# Altium schematic sheet NNP-DWG-125-001-000 PG4 Schematic Drawing Pg8.SchDoc
size B; Organization: Synapse Biomedical Inc.; Address1: 300 Artino St.; Address2: Oberlin, OH 44074; DocumentNumber: 51-2002-01; Revision: 04; SheetNumber: 8; SheetTotal: 8; PageSetup: Record=PageOptions|CenterHorizontal=True|CenterVertical=True|PrintScale=1.09|XCorrection=1.00|YCorrection=1.00|PrintKind=0|BorderSize=5000000|LeftOffset=0|BottomOffset=0|Orientation=2|PaperLength=4318|PaperWidth=2794|Scale=100|PaperSource=7|PrintQuality=-3|MediaType=1|DitherType=10|PrintScaleMode=1|PaperKind=11" x 17"|PaperIndex=17
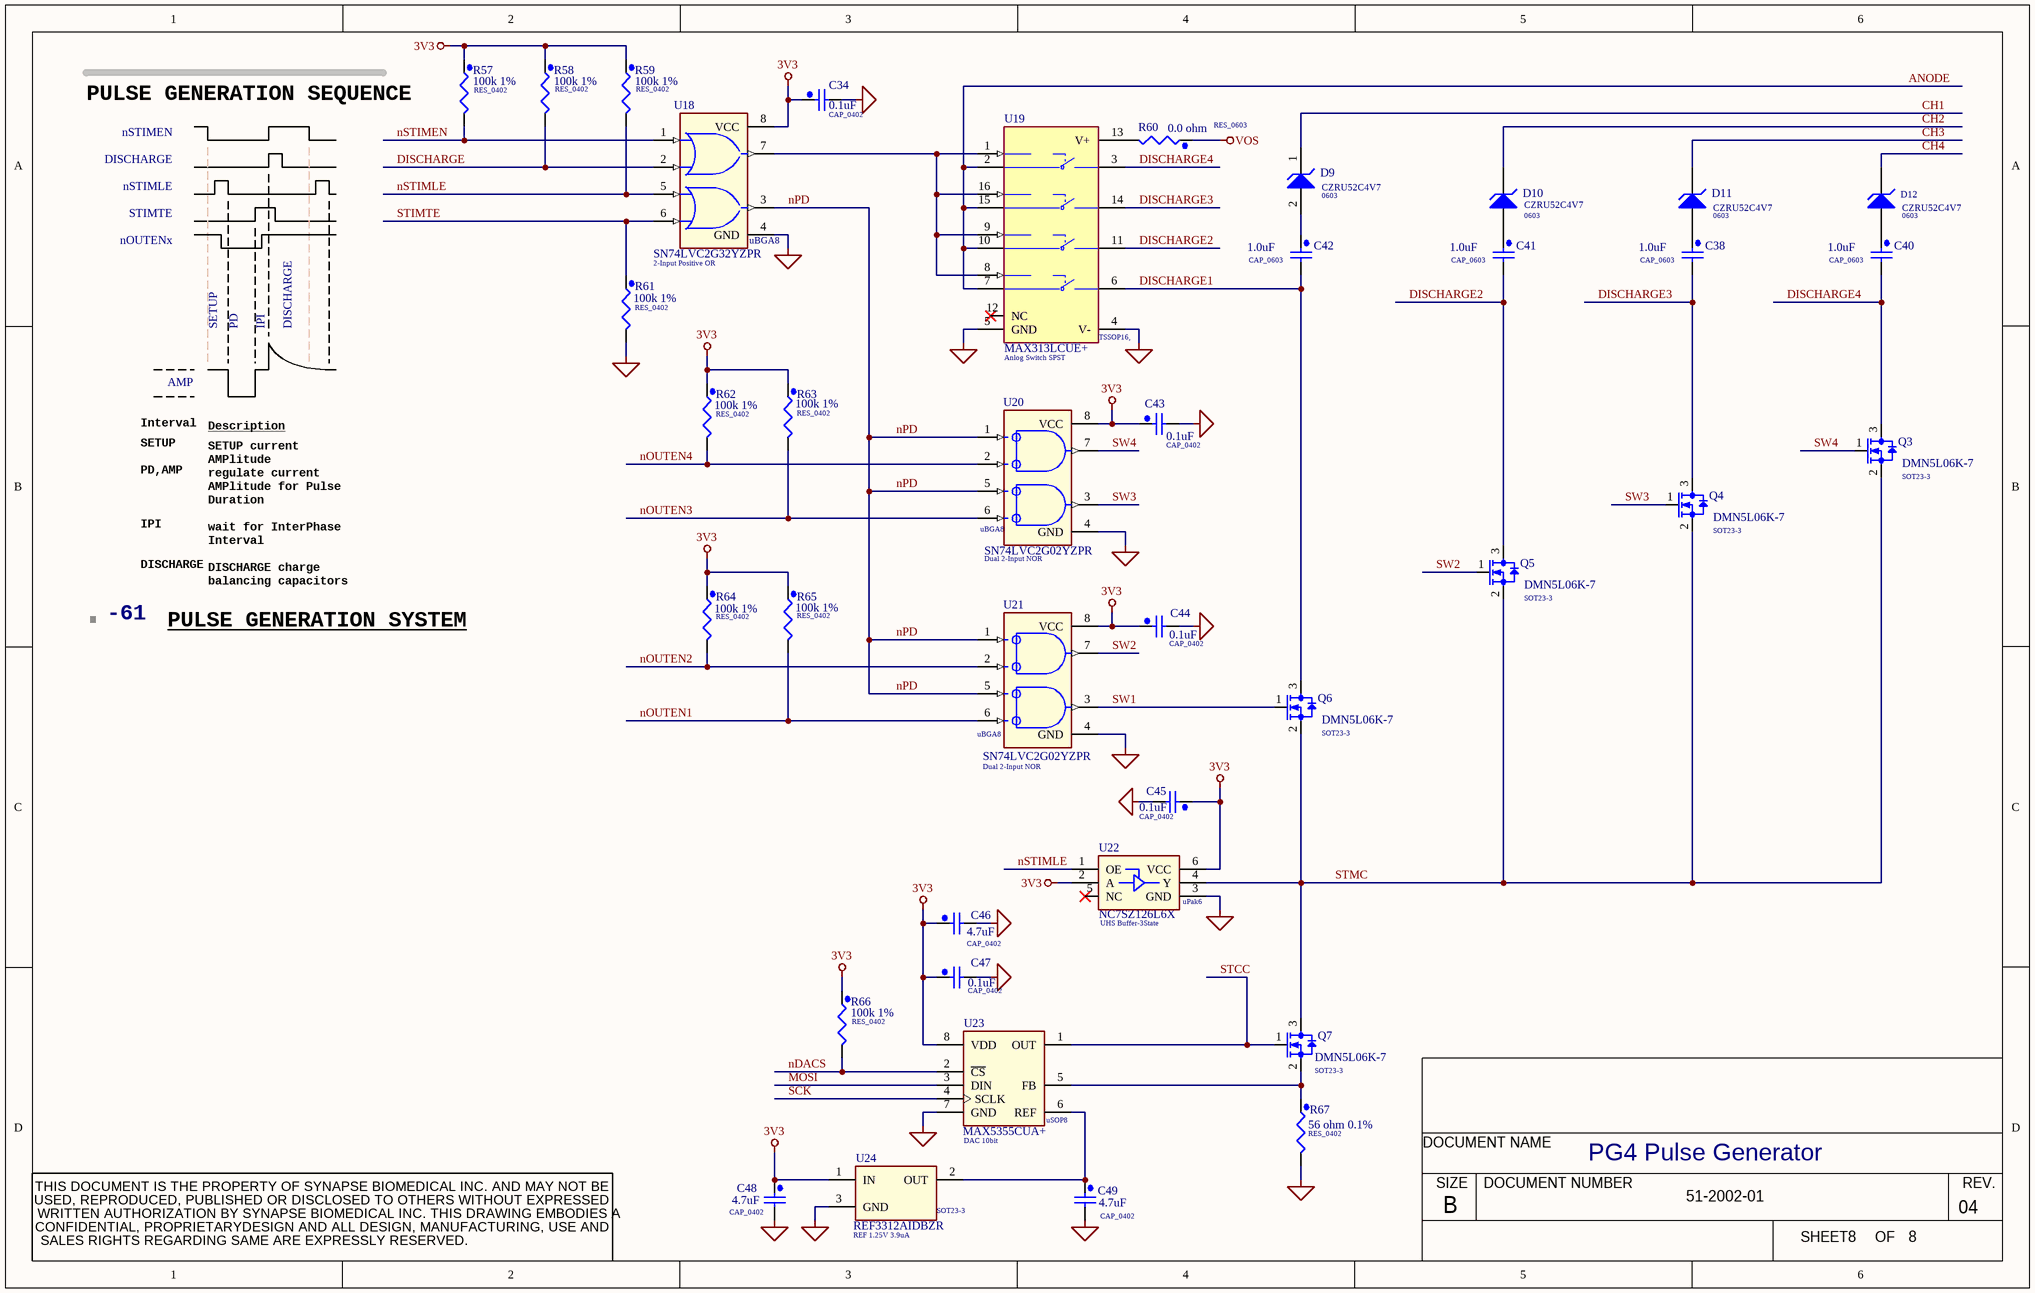
[diagram p0: NNP-DWG-125-001-000 PG4 Schematic Drawing Pg8.SchDoc]

## Parts
-61  XDESCRIPTION: PULSE GENERATION SYSTEM  (hidden comment: BOM_S1)  (no BOM)
C34  value 0.1uF  [CAP_0402]  (hidden comment: C_100n_X7R_16_0402_10%)
C38  value 1.0uF  [CAP_0603]  (hidden comment: C_1u_X5R_50_0603_10%)
C40  value 1.0uF  [CAP_0603]  (hidden comment: C_1u_X5R_50_0603_10%)
C41  value 1.0uF  [CAP_0603]  (hidden comment: C_1u_X5R_50_0603_10%)
C42  value 1.0uF  [CAP_0603]  (hidden comment: C_1u_X5R_50_0603_10%)
C43  value 0.1uF  [CAP_0402]  (hidden comment: C_100n_X7R_16_0402_10%)
C44  value 0.1uF  [CAP_0402]  (hidden comment: C_100n_X7R_16_0402_10%)
C45  value 0.1uF  [CAP_0402]  (hidden comment: C_100n_X7R_16_0402_10%)
C46  value 4.7uF  [CAP_0402]  (hidden comment: C_4u7_X5R_6V3_0402_20%)
C47  value 0.1uF  [CAP_0402]  (hidden comment: C_100n_X7R_16_0402_10%)
C48  value 4.7uF  [CAP_0402]  (hidden comment: C_4u7_X5R_6V3_0402_20%)
C49  value 4.7uF  [CAP_0402]  (hidden comment: C_4u7_X5R_6V3_0402_20%)
D9  PackageDescription: 0603  MPN: CZRU52C4V7  [DIODES_SOD-523FL]  (hidden comment: Zener Diode, 15V, 150mW, 0603, RoHS)
D10  PackageDescription: 0603  MPN: CZRU52C4V7  [DIODES_SOD-523FL]  (hidden comment: Zener Diode, 15V, 150mW, 0603, RoHS)
D11  PackageDescription: 0603  MPN: CZRU52C4V7  [DIODES_SOD-523FL]  (hidden comment: Zener Diode, 15V, 150mW, 0603, RoHS)
D12  PackageDescription: 0603  MPN: CZRU52C4V7  [DIODES_SOD-523FL]  (hidden comment: Zener Diode, 15V, 150mW, 0603, RoHS)
Q3  value DMN5L06K-7  [SOT23-3]  (hidden comment: M_50_300m_SOT23)
Q4  value DMN5L06K-7  [SOT23-3]  (hidden comment: M_50_300m_SOT23)
Q5  value DMN5L06K-7  [SOT23-3]  (hidden comment: M_50_300m_SOT23)
Q6  value DMN5L06K-7  [SOT23-3]  (hidden comment: M_50_300m_SOT23)
Q7  value DMN5L06K-7  [SOT23-3]  (hidden comment: M_50_300m_SOT23)
R57  value 100k 1%  [RES_0402]  (hidden comment: R_100k_0402)
R58  value 100k 1%  [RES_0402]  (hidden comment: R_100k_0402)
R59  value 100k 1%  [RES_0402]  (hidden comment: R_100k_0402)
R60  value 0.0 ohm  [RES_0603]  (hidden comment: R_0_0603)
R61  value 100k 1%  [RES_0402]  (hidden comment: R_100k_0402)
R62  value 100k 1%  [RES_0402]  (hidden comment: R_100k_0402)
R63  value 100k 1%  [RES_0402]  (hidden comment: R_100k_0402)
R64  value 100k 1%  [RES_0402]  (hidden comment: R_100k_0402)
R65  value 100k 1%  [RES_0402]  (hidden comment: R_100k_0402)
R66  value 100k 1%  [RES_0402]  (hidden comment: R_100k_0402)
R67  value 56 ohm 0.1%  [RES_0402]  (hidden comment: R_56_0402_0%1)
U18  2-Input Positive OR  PackageDescription: uBGA8  MPN: SN74LVC2G32YZPR  [DSBGA-8-YZP]
U19  Anlog Switch SPST  PackageDescription: TSSOP16,  MPN: MAX313LCUE+  [TSSOP16]
U20  Dual 2-Input NOR  PackageDescription: uBGA8  MPN: SN74LVC2G02YZPR  [DSBGA-8-YZP]
U21  Dual 2-Input NOR  PackageDescription: uBGA8  MPN: SN74LVC2G02YZPR  [DSBGA-8-YZP]
U22  UHS Buffer-3State  [uPak6]
U23  DAC 10bit  PackageDescription: uSOP8  [uSOP-8L]
U24  REF 1.25V 3.9uA  MPN: REF3312AIDBZR  [SOT23-3]

## Nets
3V3: C34.1 C43.1 C44.1 C45.1 C46.1 C47.1 C48.1 R57.1 R58.1 R59.1 R62.1 R63.1 R64.1 R65.1 R66.1 U18.8(VCC) U20.8(VCC) U21.8(VCC) U22.2(A) U22.6(VCC) U23.8(VDD) U24.1(IN)
GND: C34.2 C43.2 C44.2 C45.2 C46.2 C47.2 C48.2 C49.2 R61.2 R67.2 U18.4(GND) U19.4(V-) U19.5(GND) U20.4(GND) U21.4(GND) U22.3(GND) U23.7(GND) U24.3(GND)
VOS: R60.1
ANODE: U19.2(COM1) U19.7(COM4) U19.10(COM3) U19.15(COM2)
CH1: D9.1
CH2: D10.1(C)
CH3: D11.1(C)
CH4: D12.1(C)
DISCHARGE: R58.2 U18.2(1B)
DISCHARGE1: C42.2 Q6.3(D) U19.6(NO4)
DISCHARGE2: C41.2 Q5.3(D) U19.11(NO3)
DISCHARGE3: C38.2 Q4.3(D) U19.14(NO2)
DISCHARGE4: C40.2 Q3.3(D) U19.3(NO1)
MOSI: U23.3(DIN)
nDACS: R66.2 U23.2(~{CS})
nOUTEN1: R65.2 U21.6(2B)
nOUTEN2: R64.2 U21.2(1B)
nOUTEN3: R63.2 U20.6(2B)
nOUTEN4: R62.2 U20.2(1B)
nPD: U18.3(2Y) U20.1(1A) U20.5(2A) U21.1(1A) U21.5(2A)
nSTIMEN: R57.2 U18.1(1A)
nSTIMLE: R59.2 U18.5(2A) U22.1(OE)
SCK: U23.4(SCLK)
STCC: Q7.1(G) U23.1(OUT)
STIMTE: R61.1 U18.6(2B)
STMC: Q3.2(S) Q4.2(S) Q5.2(S) Q6.2(S) Q7.3(D) U22.4(Y)
SW1: Q6.1(G) U21.3(2Y)
SW2: Q5.1(G) U21.7(Y)
SW3: Q4.1(G) U20.3(2Y)
SW4: Q3.1(G) U20.7(Y)
NetC38_1: C38.1 D11.2(A)
NetC40_1: C40.1 D12.2(A)
NetC41_1: C41.1 D10.2(A)
NetC42_1: C42.1 D9.2(A)
NetC49_1: C49.1 U23.6(REF) U24.2(OUT)
NetQ7_2: Q7.2(S) R67.1 U23.5(FB)
NetR60_2: R60.2 U19.13(V+)
NetU18_7: U18.7(Y) U19.1(IN1) U19.8(IN_4) U19.9(IN3) U19.16(IN2)

Not connected (* = marked no-connect by the designer): U19 12(NC)*; U22 5(NC)*

## Notes on the sheet
- PULSE GENERATION SEQUENCE
- DISCHARGE
- nSTIMEN
- nSTIMLE
- STIMTE
- nOUTENx
- SETUP
- PD
- IPI
- Interval
- AMP
- Description
- PD,AMP
- SETUP current AMPlitude
- regulate current AMPlitude for Pulse Duration
- wait for InterPhase Interval
- DISCHARGE charge balancing capacitors
- PG4 Pulse Generator
- THIS DOCUMENT IS THE PROPERTY OF SYNAPSE BIOMEDICAL INC. AND MAY NOT BE
- DOCUMENT NAME
- SALES RIGHTS REGARDING SAME ARE EXPRESSLY RESERVED.
- USED, REPRODUCED, PUBLISHED OR DISCLOSED TO OTHERS WITHOUT EXPRESSED
- CONFIDENTIAL, PROPRIETARYDESIGN AND ALL DESIGN, MANUFACTURING, USE AND
- WRITTEN AUTHORIZATION BY SYNAPSE BIOMEDICAL INC. THIS DRAWING EMBODIES A
- SIZE
- B
- DOCUMENT NUMBER
- SHEET
- OF
- REV.

## Library data of the parts
-61 = BOM_S1: BOM item small graphic
C34 C43-C45 C47 = GRM155R71C104KA88D: 0.1uF, 16V, X7R, 0402, RoHS; MFR: Murata Electronics North America; VTPN: CC5100-KJX16R13; SBI: 51-0040-1; NNPN: 00-20-1072; PackageDescription: CAP_0402; Supplier 1: Digi-Key; Supplier Part Number 1: 490-3261-2-ND; MPN: GRM155R71C104KA88D
C38 = UMK107BJ105KA-T: 1uF, 50V, X5R, 10%, 0603, RoHS; MFR: Murata Electronics North America; MPN: GRM188R61H105KAALD; VTPN: CC6100-KHA50RC7; SBI: 53-0037; MNP2: GRT188R61H105KE13D; NNPN: 00-20-1078; PackageDescription: CAP_0603; Supplier 1: Digi-Key; Supplier Part Number 1: 490-10732-6-ND; Name Value: *; Supplier Part Number 2: 490-12330-2-ND
C40-C42 = UMK107BJ105KA-T: 1uF, 50V, X5R, 10%, 0603, RoHS; MFR: Murata Electronics North America; MPN: GRM188R61H105KAALD; VTPN: CC6100-KHA50RC7; SBI: 53-0037; NNPN: 00-20-1078; PackageDescription: CAP_0603; Supplier 1: Digi-Key; Supplier Part Number 1: 490-10732-6-ND; Supplier Part Number 2: 490-12330-2-ND
  C40 C42: MPN2: GRT188R61H105KE13D
C46 C48 C49 = ECJ-0EB0J475M: 4.7uF, 6.3V, X5R, 20%, 0402, RoHS; MFR: Murata Electronics North America; MPN: GRM155R60J475ME47D; VTPN: CC6470-MJA06R16; SBI: 51-0042; NNPN: 00-20-0755; PackageDescription: CAP_0402; Supplier 1: Digi-Key; Supplier Part Number 1: 490-5915-6-ND
D9-D12 = DFLZ15-7: Zener Diode, 4.7V, 150 mW, 0603, RoHS; MFR: Comchip Technology; Value: CZRU52C4V7; SBI: 54-0077; Supplier 1: Digi-Key; Supplier Part Number 1: 641-1028-1-ND
Q3-Q7 = DMN5L06K-7: N-Channel MOSFET, 50V, 300mA, SOT23, RoHS; MFR: Diodes Incorporated; VTPN: TSDMN5L0-S0RC7; SBI: 54-0051; NNPN: 00-06-2516; PackageDescription: SOT23-3; Supplier 1: Digi-Key; Supplier Part Number 1: DMN5L06KDIDKR-ND; MPN: DMN5L06K-7
R57-R59 R61-R66 = MCR01MZPF1003: 100k ohm, 1%, 1/16W, smd, 0402, RoHS; MFR: Vishay Dale; MPN: CRCW04025K10FKED; VTPN: RC5100-FI006R15; sbi: 53-0049-5; NNPN: 00-11-1484; PackageDescription: RES_0402; Supplier 1: Digi-Key; Supplier Part Number 1: 541-5.10KLDKR-ND
R60 = MCR03ERTJ000: 0.0 ohm, 1/10W, 0603, RoHS; MFR: Vishay Dale; VTPN: RC0000-BH010RC9; SBI: 53-0050; NNPN: 00-11-2000; PackageDescription: RES_0603; Supplier 1: Digi-Key; Supplier Part Number 1: RHM0.0CGCT-ND; MPN: MCR03ERTJ000
R67 = RG1005P-560-B-T5: 56 ohm, 0.1%, 1/16W, 0402, RoHS; MFR: Vishay Dale; MPN: CRCW040256R0FKED; VTPN: RC1560-BI006RC7; SBI: 53-0049-16; NNPN: 00-11-1600; PackageDescription: RES_0402; Supplier 1: Digi-Key; Supplier Part Number 1: 541-56.0LDKR-ND
U18 = SN74LVC2G32YEA: 2-Input Positive OR, 1.65-5.5V,  uBGA8, RoHS; MFR: Texas Instruments; VTPN: ERVSN74LV-SRC8; SBI: 54-0067; NNPN: 00-04-1015; Supplier 1: Digi-Key; Supplier Part Number 1: 296-15350-1-ND
U19 = MAX313LCUE: Analog Switch, 10ohm, QUAD SPST, TSSOP16, RoHS; MFR: Maxim Integrated; VTPN: EASMAX313-SRC7; SBI: 54-0068; NNPN: 00-02-1001; Supplier 1: Digi-Key; Supplier Part Number 1: MAX313LCUE+-ND
U20 U21 = SN74LVC2G02YEA: Dual 2-Input NOR, 1.65-5.5V, uBGA8, RoHS; MFR: Texas Instruments; VTPN: EINSN74LV-SRC7; SBI: 54-0069; NNPN: 00-04-1014; Supplier 1: Digi-Key; Supplier Part Number 1: 296-13731-1-ND; MPN2: SN74LVC2G02YZPR; Supplier Part Number 2: 296-18799-2-ND
  U20: Parameter 1: *
U22 = NC7SZ126L6X: UHS Buffer Tri-State, uPAK6, RoHS; MFR: Fairchild Semiconductor; VTPN: EINNC7SZ1-SRC9; SBI: 54-0070; Supplier Part Number 1: NC7SZ126L6XFSDKR-ND; Supplier 1: Mouser; PackageDescription: uPak6; NNPN: 00-04-1028; MPN: NC7SZ126L6X
U23 = MAX5355CUA+: DAC 10bit, uSOP8, RoHS; MFR: Maxim Integrated; VTPN: EASMAX535-SRC7; SBI: 54-0071; ComponentLink1URL: Q:\00\02\00-02-0500 Maxim MAX5354,MAX5355.pdf; NNPN: 00-02-0502; Supplier 1: Digi-Key; Supplier Part Number 1: MAX5355CUA+-ND; MPN: MAX5355CUA+
U24 = REF3312AIDCK: REF 1.25V, 3.9uA, SOT23-3, RoHS; MFR: Texas Instruments; SBI: 54-0072; PackageDescription: SOT23-3; Supplier 1: Digi-Key; Supplier Part Number 1: 296-41484-6-ND